# EAGLE design Thermostat (EAGLE 6.3)
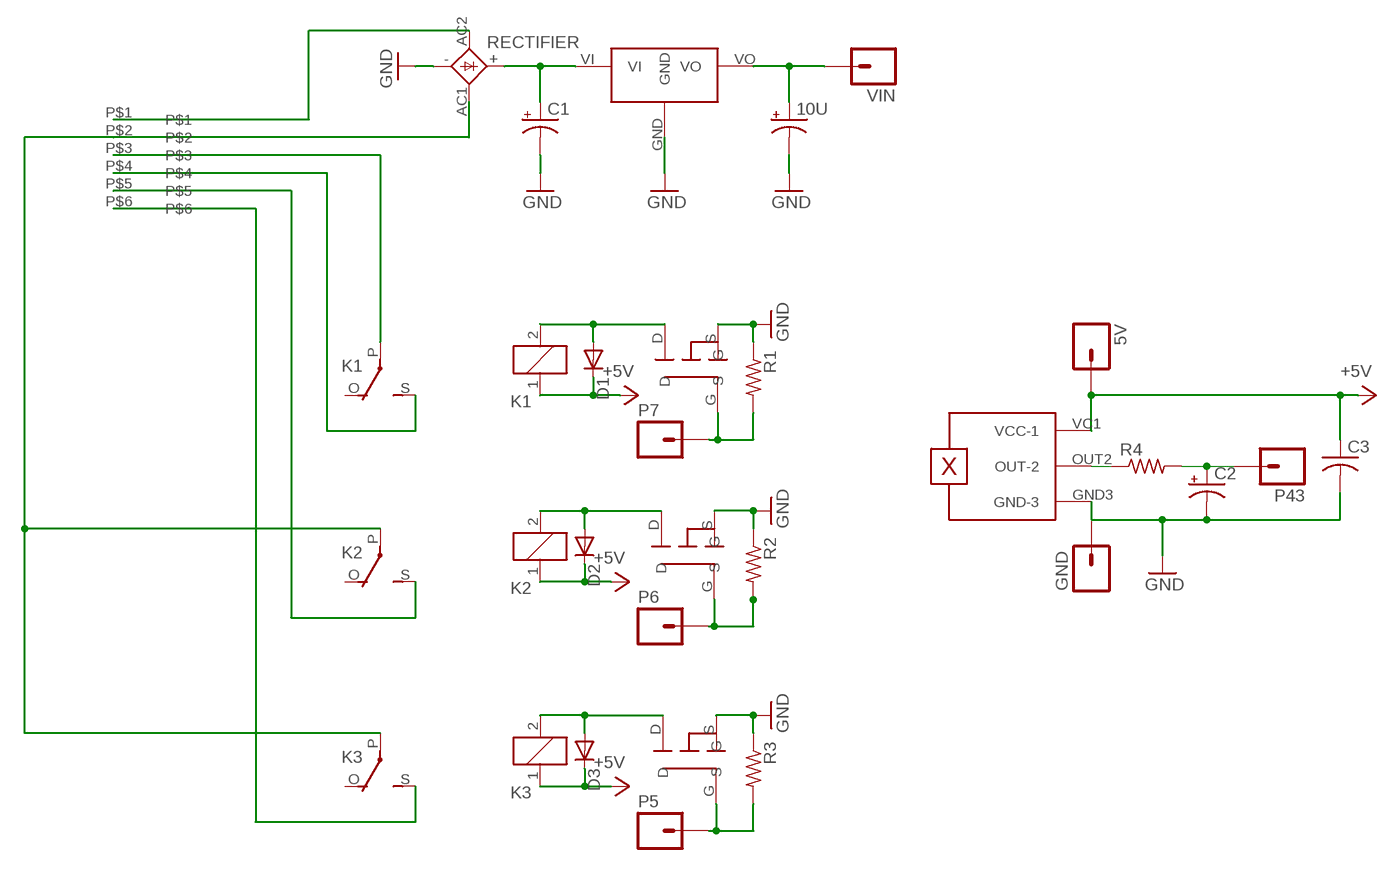
[diagram p0: schematic, sheet 1]

## Parts
5V  M01PTH  [1X01]
10U  CAP_POLPTH2  [CPOL-RADIAL-10UF-25V]
C1  CPOL-USE5-10.5  [E5-10,5]
C2  CPOL-USE2-5  [E2-5]
C3  C-US050-024X044  [C050-024X044]
D1  1N4446  [DO35-10]
D2  1N4446  [DO35-10]
D3  1N4446  [DO35-10]
GND  M01PTH  [1X01]
K1  G5LE  [G5LE]
K2  G5LE  [G5LE]
K3  G5LE  [G5LE]
P5  M01PTH  [1X01]
P6  M01PTH  [1X01]
P7  M01PTH  [1X01]
P43  M01PTH  [1X01]
R1  R-US_0204/7  [0204/7]
R2  R-US_0204/7  [0204/7]
R3  R-US_0204/7  [0204/7]
R4  R-US_0204/7  [0204/7]
RECTIFIER  GBU4  [GBU4S]
U$1  TMP36  [TMP36]
U$2  V715W-500R  [SWITCHINGREGULATOR]
U$3  PHOENIX-651-1935200  [PHOENIX_E_5MM_6PIN]
U$4  TRANSISTOR  [TRANSISTOR]
U$5  TRANSISTOR  [TRANSISTOR]
U$6  TRANSISTOR  [TRANSISTOR]
VIN  M01PTH  [1X01]

## Nets
+5V: 5V.1 C3.1 D1.C D2.C D3.C K1.1 K2.1 K3.1 U$1.VC1(VCC-1)
GND: 10U.2(-) C1.- C2.- C3.2 GND.1 R1.1 R2.1 R3.1 RECTIFIER.- U$1.GND3(GND-3) U$2.GND U$4.S U$5.S U$6.S
N$1: K1.P(2:P) U$3.P$3
N$2: P6.1 R2.2 U$5.G
N$3: D2.A K2.2 U$5.D
N$4: C2.+ P43.1 R4.2
N$5: R4.1 U$1.OUT2(OUT-2)
N$6: P7.1 R1.2 U$6.G
N$7: D1.A K1.2 U$6.D
N$9: K2.P(2:P) K3.P(2:P) RECTIFIER.AC1(AC2) U$3.P$2
N$10: 10U.1(+) U$2.VO VIN.1
N$13: K3.S(2:S) U$3.P$6
N$14: K1.S(2:S) U$3.P$4
N$15: K2.S(2:S) U$3.P$5
N$17: P5.1 R3.2 U$4.G
N$18: D3.A K3.2 U$4.D
N$20: RECTIFIER.AC2(AC1) U$3.P$1
N$24: C1.+ RECTIFIER.+ U$2.VI
Unconnected: K1.O(2:O) K2.O(2:O) K3.O(2:O)

## Library data of the parts
5V GND P5-P7 P43 VIN = SparkFun-Connectors:M01: Header 1 Standard 1-pin 0.1" header. Use with straight break away headers (SKU : PRT-00116), right angle break away headers (PRT-00553), swiss pins (PRT-00743), machine pins (PRT-00117), and female headers (PRT-00115).
10U = SparkFun-Passives:CAP_POL: Capacitor Polarized These are standard SMD and PTH capacitors. Normally 10uF, 47uF, and 100uF in electrolytic and tantalum varieties. Always verify the external diameter of the through hole cap, it varies with capacity, voltage, and manufacturer. The EIA devices should be standard.
C1 C2 = rcl:CPOL-US: POLARIZED CAPACITOR, American symbol
C3 = rcl:C-US: CAPACITOR, American symbol
D1-D3 = diode:1N4446: DIODE high speed (Philips)
K1-K3 = relay:G5LE: RELAY 1 x switch, 10 A/120 V AC, 8 A/30 V DC, Omron; OC_FARNELL: unknown; OC_NEWARK: unknown
R1-R4 = rcl:R-US_: RESISTOR, American symbol
RECTIFIER = rectifier:GBU4: GENERAL INSTRUMENT RECTIFIER
U$1 = android-thermostat:TMP36
U$2 = android-thermostat:V715W-500R
U$3 = android-thermostat:PHOENIX-651-1935200
U$4-U$6 = android-thermostat:TRANSISTOR

## Board
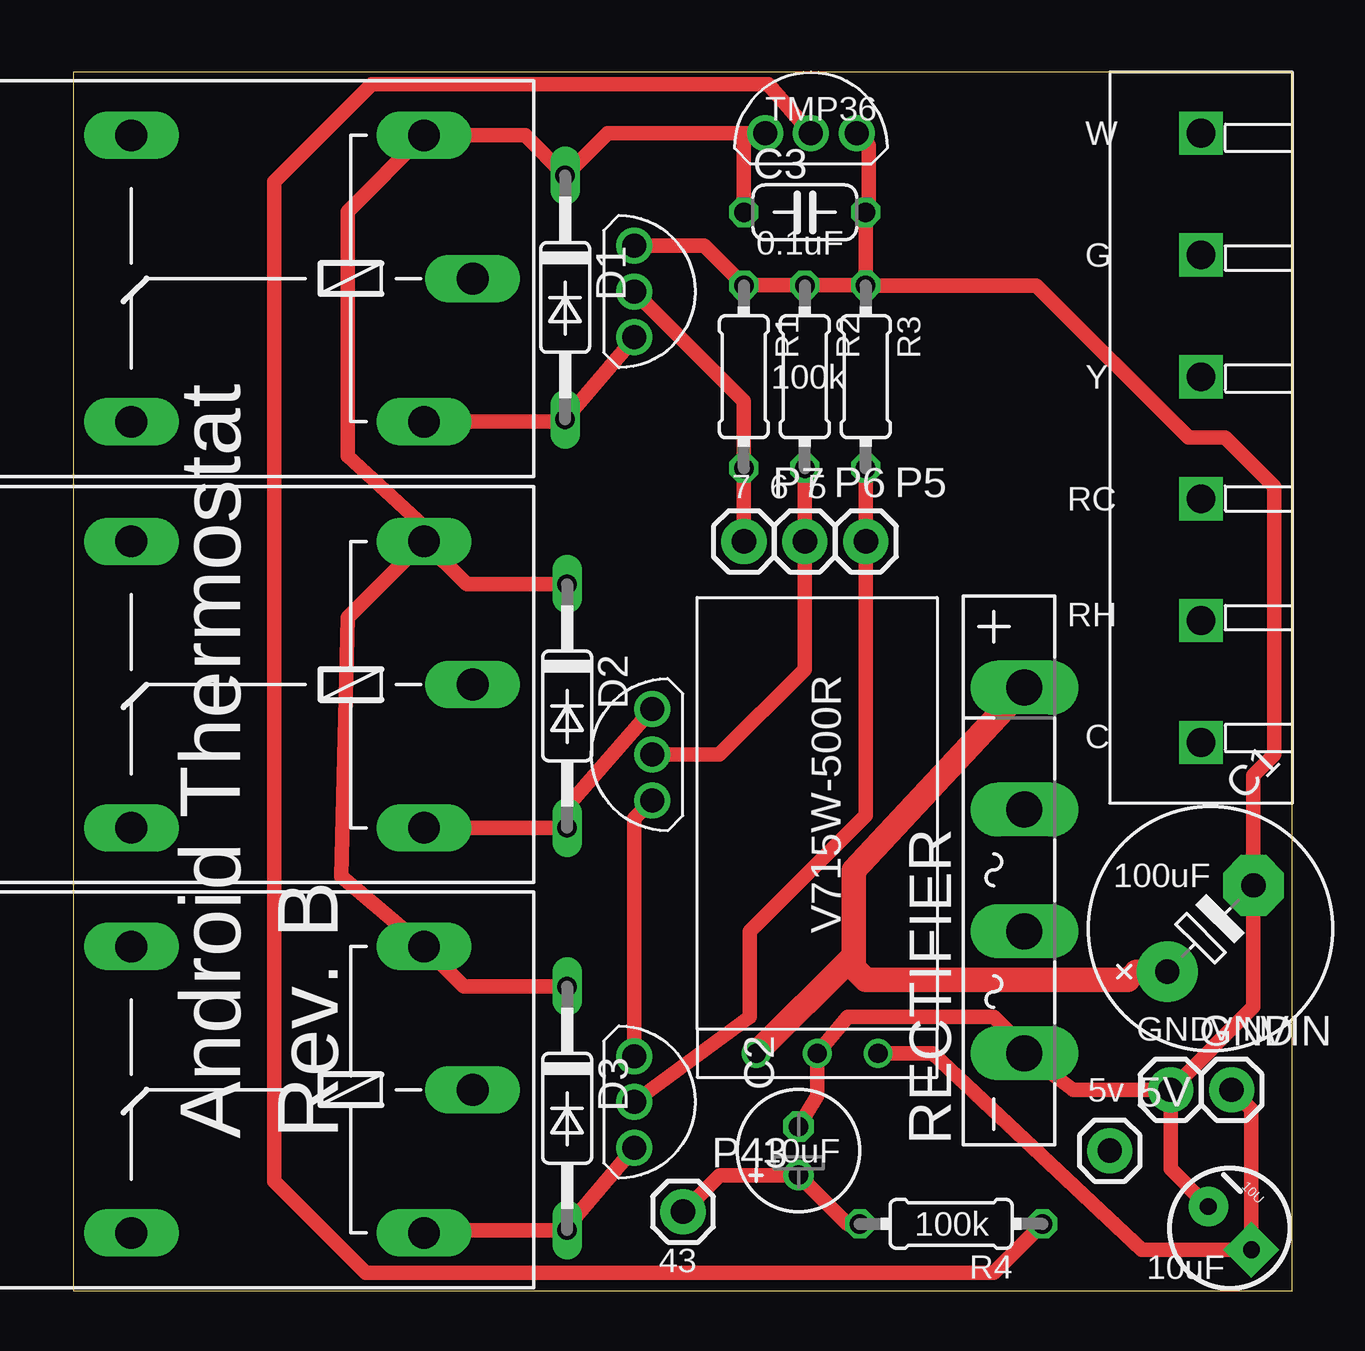
[diagram p1: board, top side]
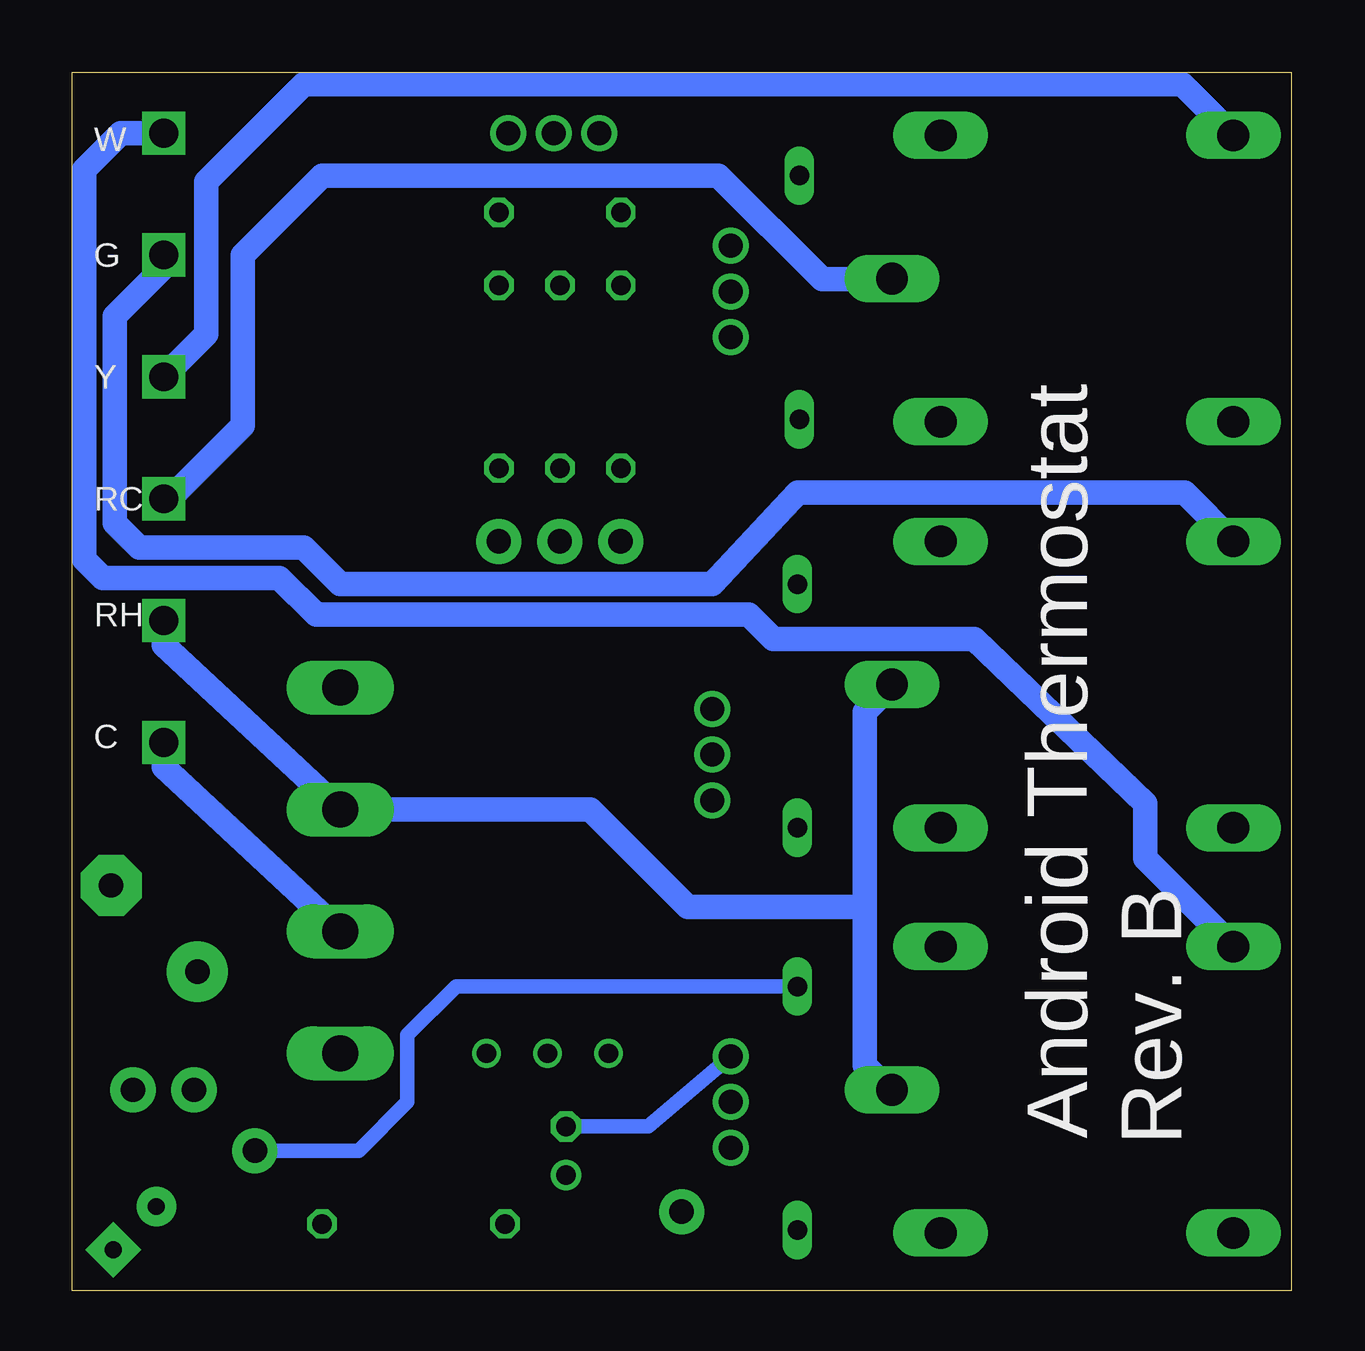
[diagram p2: board, bottom side, seen from below]

Size 50.8 x 50.8 mm. Coordinates in mm from the lower left corner, seen from the top.
Outline: 0,0 50.8,0 50.8,50.8 0,50.8 0,0
Copper layers (1*16): Top 0.0356mm / dielectric 1.5011mm / Bottom 0.0356mm
Design rules "LaenPCBOrder": minimum track width 6mil, minimum drill 13mil, track to track 6mil, track to pad 6mil, pad to pad 6mil, via to via 6mil, smd to smd 6mil, copper to edge 15mil, drill to drill 6mil, minimum pad ring 7mil, minimum via ring 7mil, stop-mask expansion 4mil, vias tented up to drill 0mil, thermal gap 10mil

### Footprints (pad centres in the part's own frame; a part is rotated, then mirrored left to right if it is on the bottom)
1X01 = drill 1.016 pad 1.88: 1 0,0
CPOL-RADIAL-10UF-25V = drill 0.7 pad 1.651 square: 1 1.27,0 | drill 0.7 pad 1.651: 2 -1.27,0
E5-10,5 = drill 1.016 pad 2.54: + -2.54,0 | drill 1.016 pad 2.54 octagon: - 2.54,0
E2-5 = drill 0.813 pad 1.27: + -1.016,0 | drill 0.813 pad 1.27 octagon: - 1.016,0
C050-024X044 = drill 0.813 octagon: 1 -2.54,0; 2 2.54,0
DO35-10 = drill 0.813 long: A 5.08,0; C -5.08,0
G5LE = drill 1.321 long: 1 -7.493,-5.969; 2 -7.493,5.969; O 4.699,5.969; P -9.525,0; S 4.699,-5.969
0204/7 = drill 0.813 octagon: 1 -3.81,0; 2 3.81,0
GBU4S = drill 1.499 long: + 7.62,0; - -7.62,0; AC1 2.54,0; AC2 -2.54,0
TMP36 = drill 1: GND3 0,-1.905; OUT2 0,0; VC1 0,1.905
SWITCHINGREGULATOR = drill 0.8: GND 0,0; VI 0,2.54; VO 0,-2.54
PHOENIX_E_5MM_6PIN = drill 1.2 square: P$1 0,-12.7; P$2 0,-7.62; P$3 0,-2.54; P$4 0,2.54; P$5 0,7.62; P$6 0,12.7
TRANSISTOR = drill 1: D 0,-1.905; G 0,0; S 0,1.905

### Placement (x,y rotation side)
5V  43.19,5.84 0 top
10U  48.19,2.61 315 top
C1  47.38,15.1 45 top
C2  30.23,5.84 90 top
C3  30.48,44.96 0 top
D1  20.5,41.41 270 top
D2  20.58,24.38 270 top
D3  20.58,7.61 270 top
GND  45.73,8.38 0 top
K1  7.12,42.19 180 top
K2  7.12,25.27 180 top
K3  7.12,8.38 180 top
P5  33.03,31.24 0 top
P6  30.49,31.24 0 top
P7  27.95,31.24 0 top
P43  25.41,3.3 0 top
R1  27.94,38.11 270 top
R2  30.48,38.11 270 top
R3  33.02,38.11 270 top
R4  36.58,2.79 180 top
RECTIFIER  39.63,17.53 90 top
U$1  30.74,48.26 90 top
U$2  31,9.91 90 top
U$3  46.99,35.56 0 top
U$4  23.37,7.87 0 top
U$5  24.13,22.35 180 top
U$6  23.37,41.66 0 top
VIN  48.27,8.38 0 top

### Tracks (layer width: path | path; a pad name or v marks a point on that pad's centre or on a via)
+5V
  Top 0.61: D3.C 16.27,12.69 K3.1 11.18,17.27 11.43,28.06 K2.1 | K2.1 14.61,31.87 11.43,34.8 11.43,44.98 K1.1 18.82,48.16 D1.C 22.27,48.26 27.94,48.26 | D2.C 16.39,29.46 K2.1 | U$1.VC1 27.94,48.26 | C3.1 27.94,48.26
  Bottom 0.61: D3.C 34.81,12.69 36.83,10.67 36.83,7.87 38.86,5.84 5V.1
GND
  Top 0.61: 10U.2 45.72,5.08 GND.1 | GND.1 49.18,11.83 C1.- 49.18,21.49 50.04,22.35 50.04,33.53 48.01,35.56 46.48,35.56 40.13,41.91 R3.1 | GND.1 41.66,8.38 RECTIFIER.- 39.88,9.91 38.36,11.43 32.27,11.43 U$2.GND 31,8.13 C2.- | R3.1 R2.1 R1.1 26.3,43.56 U$6.S | U$4.S 23.37,19.68 U$5.S | R3.1 C3.2 33.15,44.96 33.15,47.75 U$1.GND3
  Bottom 0.61: C2.- 26.8,6.86 U$4.S
N$1
  Bottom 1.016: U$3.P$3 46.74,33.02 43.69,36.07 43.69,43.18 40.39,46.48 23.88,46.48 19.56,42.16 16.68,42.16 K1.P
N$2
  Top 0.61: R2.2 P6.1 30.48,25.91 26.93,22.35 U$5.G
N$3
  Top 0.61: K2.2 D2.A 20.58,20.2 U$5.D
N$4
  Top 0.61: R4.2 32.26,2.79 C2.+ 26.93,4.83 P43.1
N$5
  Top 0.61: U$1.OUT2 28.96,50.29 12.45,50.29 8.38,46.23 8.38,4.57 12.19,0.76 38.36,0.76 R4.1
N$6
  Top 0.61: P7.1 R1.2 27.94,37.08 U$6.G
N$7
  Top 0.61: K1.2 20.39,36.23 D1.A 23.41,39.75 U$6.D
N$9
  Bottom 1.016: U$3.P$2 46.99,26.92 RECTIFIER.AC1 29.21,20.07 25.15,16 17.78,16 | K3.P 16.77,8.38 17.78,9.4 17.78,16 | 17.78,16 17.78,24.14 K2.P
N$10
  Top 0.61: VIN.1 49.09,7.56 10U.1 44.51,1.72 35.82,9.91 U$2.VO
N$13
  Bottom 1.016: U$3.P$6 48.77,48.26 50.29,46.74 50.29,30.48 49.53,29.72 42.17,29.72 40.64,28.19 22.61,28.19 21.59,27.18 13.21,27.18 6.1,20.32 6.1,18.03 K3.S
N$14
  Bottom 1.016: U$3.P$4 45.21,39.88 45.21,46.23 41.15,50.29 4.55,50.29 K1.S
N$15
  Bottom 1.016: U$3.P$5 46.99,42.67 49.02,40.64 49.02,32 48.01,30.99 41.15,30.99 39.63,29.46 24.13,29.46 20.58,33.27 4.45,33.27 K2.S
N$17
  Top 0.61: R3.2 P5.1 33.03,19.82 28.2,14.99 28.2,11.43 U$4.G
N$18
  Top 0.61: K3.2 14.73,2.53 D3.A 20.58,2.67 U$4.D
N$20
  Bottom 1.016: U$3.P$1 46.99,21.84 RECTIFIER.AC2
N$24
  Top 1.016: 32.51,13.97 32.51,13.46 33.02,12.95 43.94,12.95 44.3,13.31 C1.+ | 32.51,13.97 32.51,17.52 RECTIFIER.+ | U$2.VI 32.51,13.97

### Text on the board
_tsilk: TMP36 | W | 0.1uF | G | 100k | Y | 7 6 5 | RC | RH | C | 100uF | GND | VIN | 5v | Android Thermostat | Rev. B | 10uF | 100k | 43 | 10uF
_bsilk: W | G | Y | RC | RH | C | Rev. B | Android Thermostat